# EAGLE design android (EAGLE 5.12)
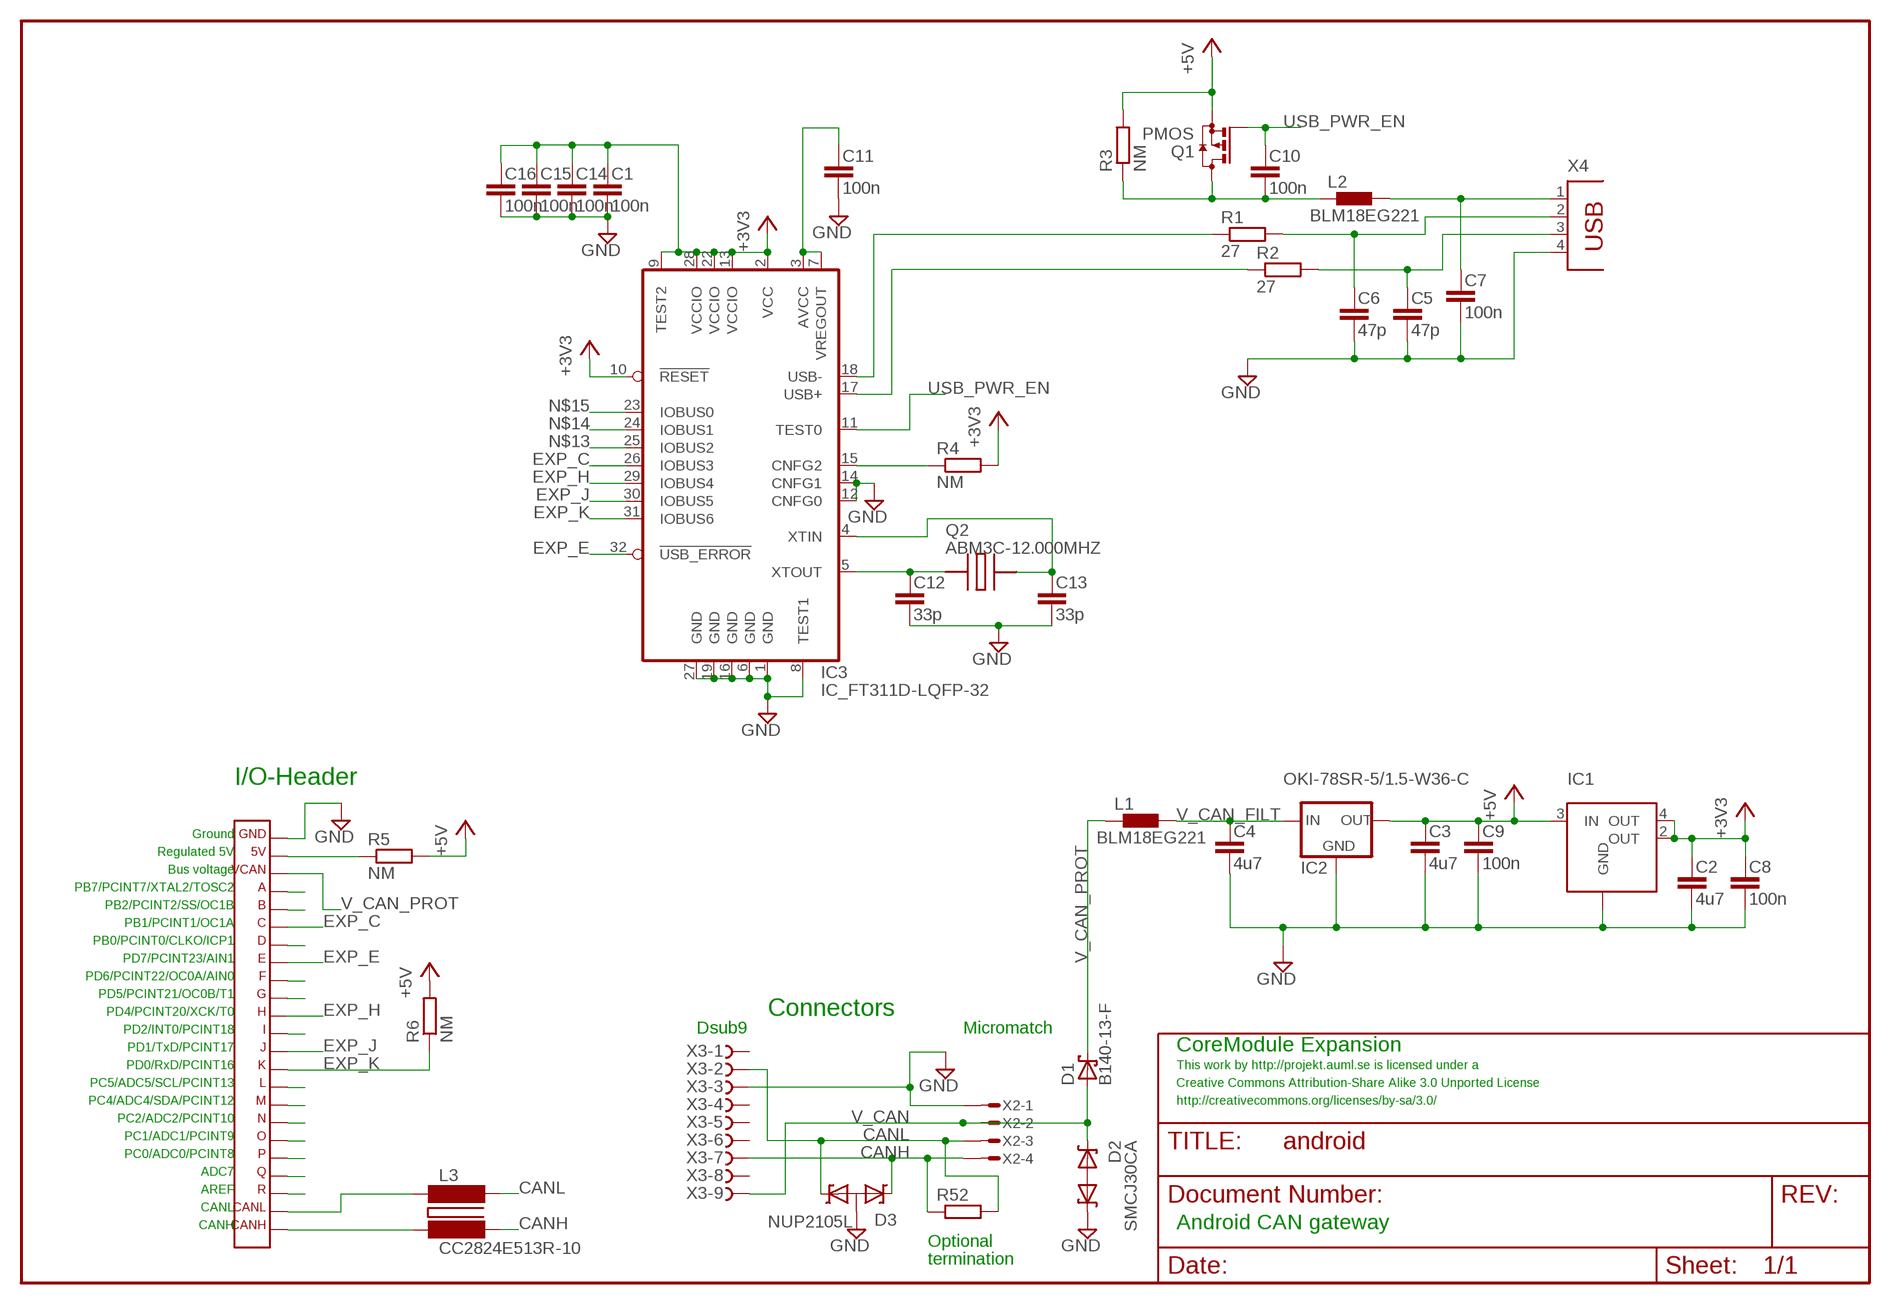
[diagram p0: schematic, sheet 1]

## Parts
C1  100n  C-EUC0603  [C0603]
C2  4u7  C-EUC0805  [C0805]
C3  4u7  C-EUC0805  [C0805]
C4  4u7  C-EUC0805  [C0805]
C5  47p  C-EUC0603  [C0603]
C6  47p  C-EUC0603  [C0603]
C7  100n  C-EUC0603  [C0603]
C8  100n  C-EUC0603  [C0603]
C9  100n  C-EUC0603  [C0603]
C10  100n  C-EUC0603  [C0603]
C11  100n  C-EUC0603  [C0603]
C12  33p  C-EUC0603  [C0603]
C13  33p  C-EUC0603  [C0603]
C14  100n  C-EUC0603  [C0603]
C15  100n  C-EUC0603  [C0603]
C16  100n  C-EUC0603  [C0603]
D1  B140-13-F  SCHOTTKY-DIODESMA  [SMA]
D2  SMCJ30CA  TVS2SMC  [SMC]
D3  NUP2105L  TVSSOT23  [SOT23]
IC1  LM1117IMPX-3.3  LM1117MP-3.3  [SOT223]
IC2  OKI-78SR-5/1.5-W36-C  78XXS"  [78XXS]
IC3  IC_FT311D-LQFP-32  [LQFP-32]
L1  BLM18EG221  L-EUL0603  [L0603]
L2  BLM18EG221  L-EUL0603  [L0603]
L3  CC2824E513R-10  CC2824E513R-10CC2824E513R-10  [CC2824E513R-10]
Q1  PMOS  [SOT23]
Q2  ABM3C-12.000MHZ  ABMMABM3C  [SMD2]
R1  27  R-EUR0603  [R0603]
R2  27  R-EUR0603  [R0603]
R3  NM  R-EUR0603  [R0603]
R4  NM  R-EUR0603  [R0603]
R5  NM  R-EUR0603  [R0603]
R6  NM  R-EUR0603  [R0603]
R52  R-EUR2010  [R2010]
X1  CORETWO_LAYOUTISPHOLES_CU  [CORETWO_LAYOUT_ISPHOLES_CU]
X2  MICROMATCH-4  [MICROMATCH-4]
X3  F09S  F09HS  [F09H]
X4  USB_TYPARECEPTACLE  [FCI_RECEPTACLE]

## Nets
+3V3: C1.1 C2.1 C8.1 C14.1 C15.1 C16.1 IC1.2(OUT) IC1.4(OUT) IC3.2(VCC) IC3.9(TEST2) IC3.10(!RESET) IC3.13(VCCIO) IC3.22(VCCIO) IC3.28(VCCIO) R4.2
+5V: C3.1 C9.1 IC1.3(IN) IC2.OUT Q1.2(S) R3.2 R5.2 R6.2
CANH: D3.1(C1) L3.3 R52.1 X2.4 X3.7
CANH_FILT: L3.2 X1.CANH
CANL: D3.2(C2) L3.4 R52.2 X2.3 X3.2
CANL_FILT: L3.1 X1.CANL
EXP_A: X1.A
EXP_B: X1.B
EXP_C: IC3.26(IOBUS3) X1.C
EXP_D: X1.D
EXP_E: IC3.32(!USB_ERROR) X1.E
EXP_F: X1.F
EXP_G: X1.G
EXP_H: IC3.29(IOBUS4) X1.H
EXP_I: X1.I
EXP_J: IC3.30(IOBUS5) X1.J
EXP_K: IC3.31(IOBUS6) R6.1 X1.K
EXP_L: X1.L
EXP_M: X1.M
EXP_N: X1.N
EXP_O: X1.O
EXP_P: X1.P
EXP_Q: X1.Q
EXP_R: X1.R
GND: C1.2 C2.2 C3.2 C4.2 C5.2 C6.2 C7.2 C8.2 C9.2 C11.2 C12.2 C13.2 C14.2 C15.2 C16.2 D2.A(C1) D3.3(A) IC1.1(GND) IC2.GND IC3.1(GND) IC3.6(GND) IC3.8(TEST1) IC3.12(CNFG0) IC3.14(CNFG1) IC3.16(GND) IC3.19(GND) IC3.27(GND) X1.GND X2.1 X3.3 X4.4
N$1: C7.1 L2.2 X4.1
N$2: C10.2 L2.1 Q1.3(D) R3.1
N$5: IC3.17(USB+) R2.1
N$6: IC3.18(USB-) R1.1
N$7: C6.1 R1.2 X4.2
N$8: C5.1 R2.2 X4.3
N$10: IC3.15(CNFG2) R4.1
N$12: C11.1 IC3.3(AVCC) IC3.7(VREGOUT)
N$13: IC3.25(IOBUS2)
N$14: IC3.24(IOBUS1)
N$15: IC3.23(IOBUS0)
N$16: C13.1 IC3.4(XTIN) Q2.2
N$17: C12.1 IC3.5(XTOUT) Q2.1
USB_PWR_EN: C10.1 IC3.11(TEST0) Q1.1(G)
V_CAN: D1.A D2.C(C2) X2.2 X3.9
V_CAN_FILT: C4.1 IC2.IN L1.2
V_CAN_PROT: D1.C L1.1 X1.VCAN
VCC: R5.1 X1.5V
Unconnected: X3.1 X3.4 X3.5 X3.6 X3.8

## Notes on the sheet
- I/O-Header
- Ground
- Regulated 5V
- Bus voltage
- PB7/PCINT7/XTAL2/TOSC2
- PB2/PCINT2/SS/OC1B
- PB1/PCINT1/OC1A
- PB0/PCINT0/CLKO/ICP1
- PD7/PCINT23/AIN1
- PD6/PCINT22/OC0A/AIN0
- PD5/PCINT21/OC0B/T1
- PD4/PCINT20/XCK/T0 | Connectors
- PD2/INT0/PCINT18 | Dsub9 | Micromatch
- PD1/TxD/PCINT17 | CoreModule Expansion
- PD0/RxD/PCINT16 | This work by http://projekt.auml.se is licensed under a
- PC5/ADC5/SCL/PCINT13 | Creative Commons Attribution-Share Alike 3.0 Unported License
- PC4/ADC4/SDA/PCINT12 | http://creativecommons.org/licenses/by-sa/3.0/
- PC2/ADC2/PCINT10
- PC1/ADC1/PCINT9
- PC0/ADC0/PCINT8
- ADC7
- AREF
- CANL
- CANH | Android CAN gateway
- Optional
- termination

## Power pins joined to a net without a drawn wire
GND: Q2.GND@0(GND) Q2.GND@1(GND)

## Library data of the parts
C1-C16 = rcl:C-EU
D1 = diode:SCHOTTKY-DIODE
D2 = diode:TVS2
D3 = diode:TVS
IC1 = lm1117mp:LM1117MP-3.3
IC2 = 78xx:78XXS: VOLTAGE REGULATOR
IC3 = dp_devices:IC_FT311D: USB Android Host Mfr no: FT311D-32L1C FT311D <http://www.ftdichip.com/Support/Documents/DataSheets/ICs/DS_FT311D.pdf>
L1 L2 = rcl:L-EU
L3 = choke:CC2824E513R-10
Q1 = transistor:PMOS
Q2 = abmm:ABMM
R1-R6 R52 = rcl:R-EU
X1 = expboard:CORETWO_LAYOUT
X2 = con-amp-micromatch:MICROMATCH-4: MicroMaTch 4 7-215464-4 / 0-215464-4 Drawing Number C-215464 DDEController.pdf
X3 = dsub:F09?S
X4 = usba:USB_TYPA

## Board
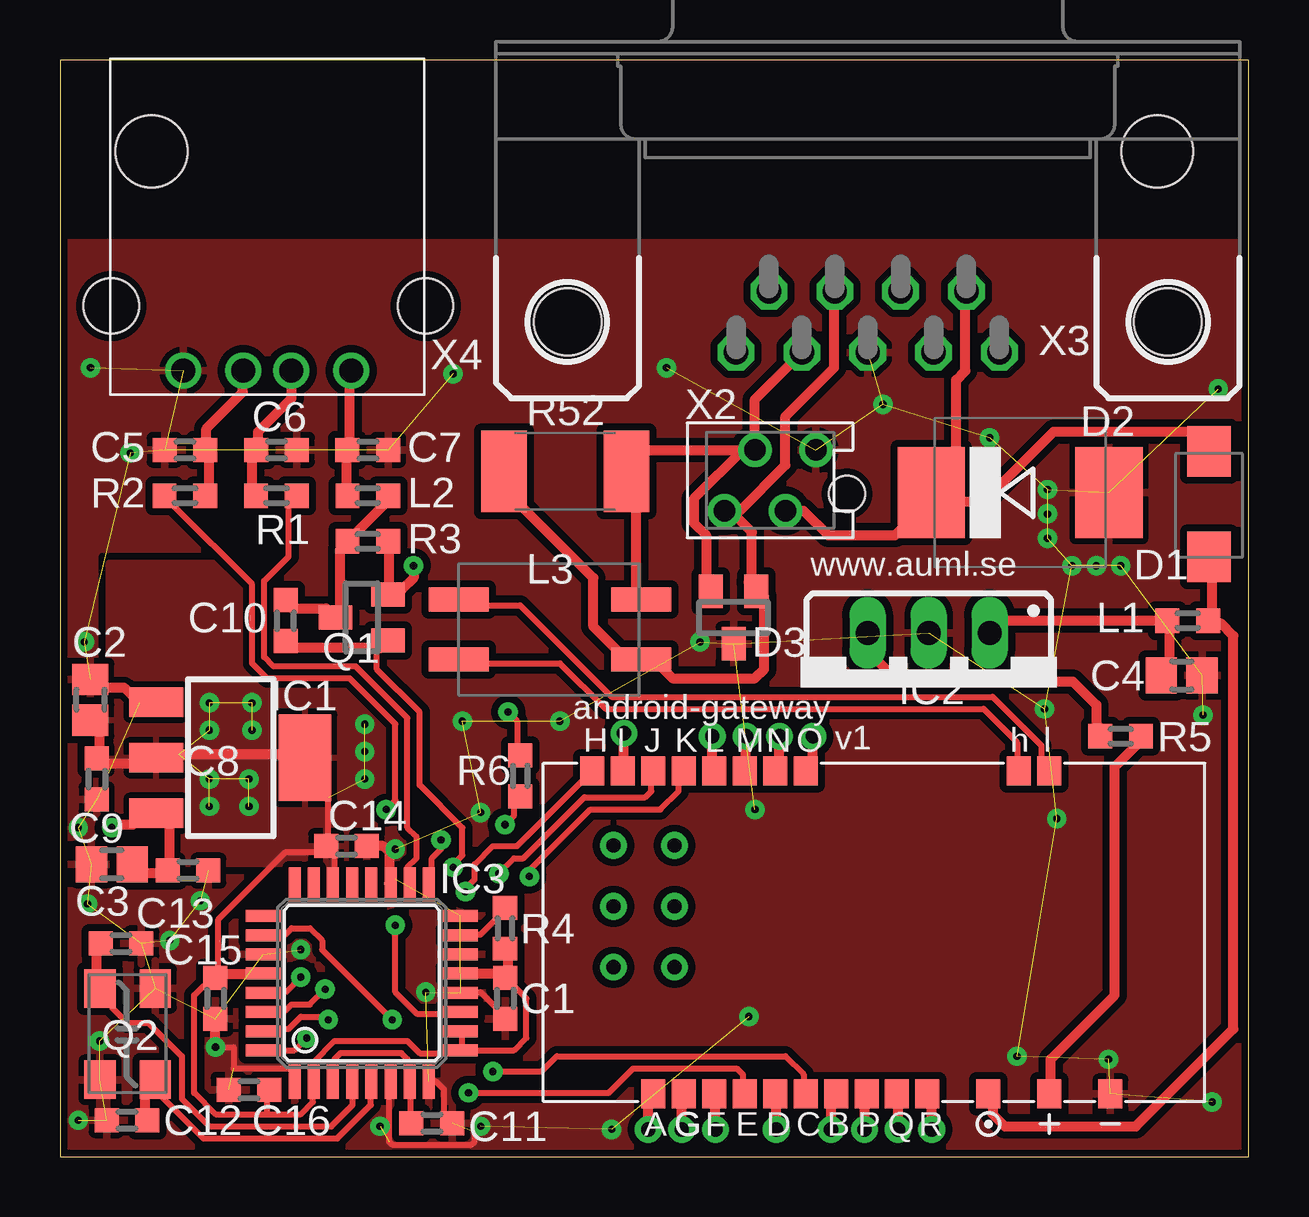
[diagram p1: board, top side]
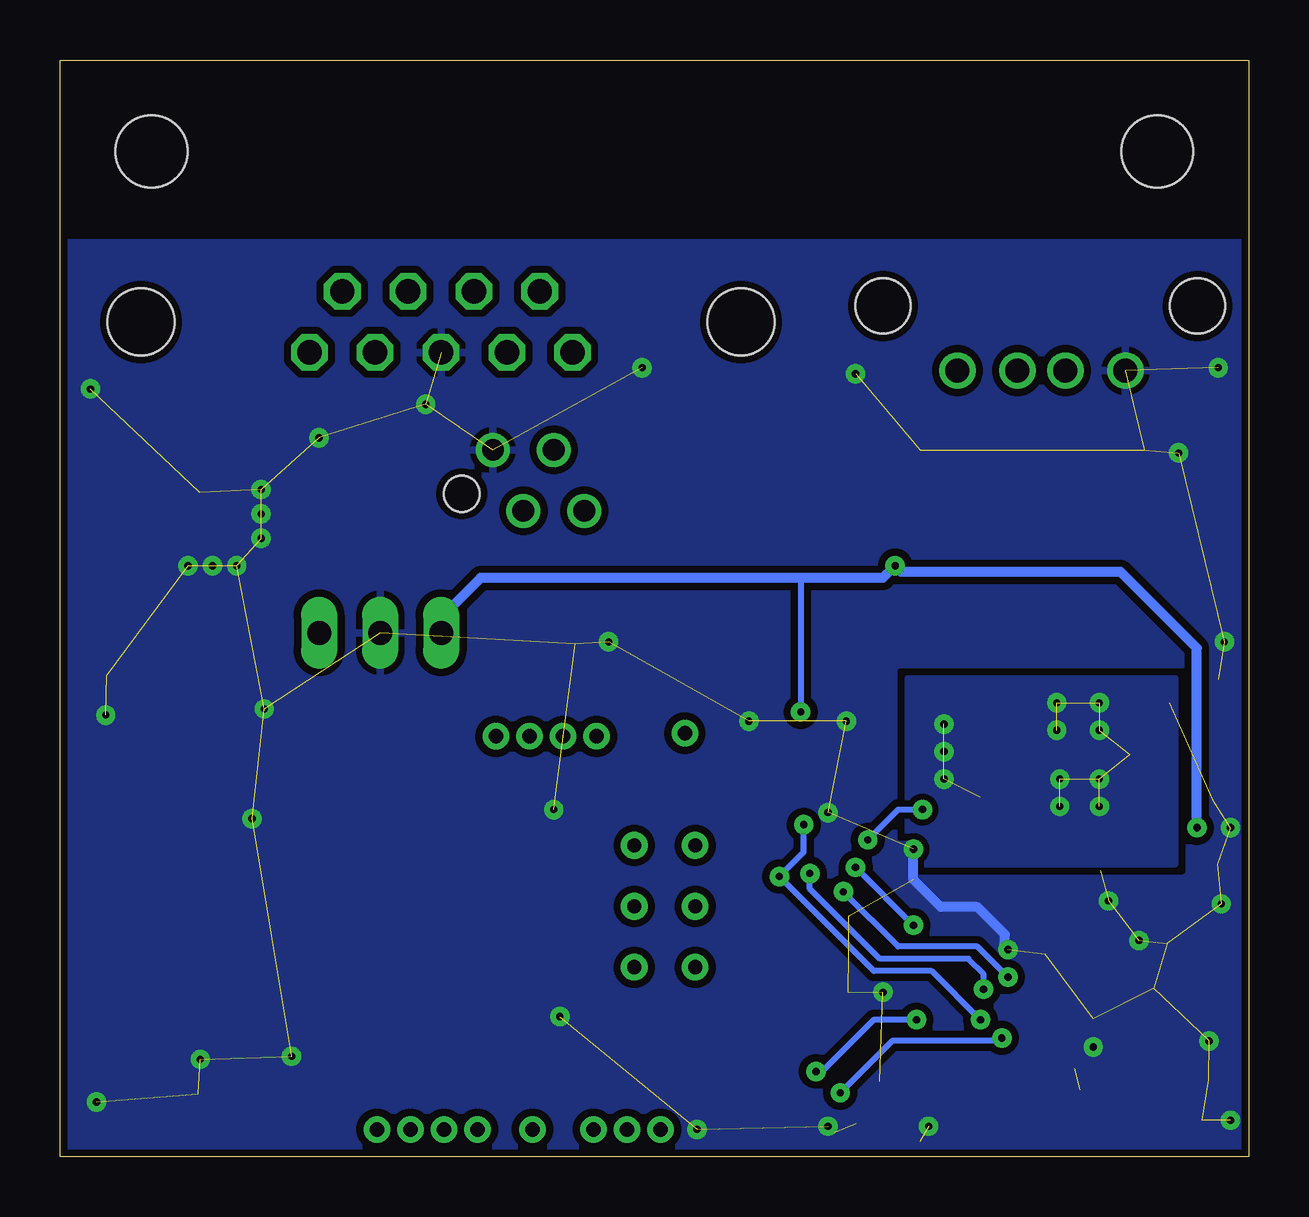
[diagram p2: board, bottom side, seen from below]

Size 49.53 x 45.72 mm. Coordinates in mm from the lower left corner, seen from the top.
Outline: 0,0 49.53,0 49.53,45.72 0,45.72 0,0
Copper layers (1*16): Top 0.035mm / dielectric 1.5mm / Bottom 0.035mm
Design rules "default *": minimum track width 10mil, minimum drill 0.3mm, track to track 10mil, track to pad 10mil, pad to pad 10mil, via to via 10mil, smd to smd 8mil, copper to edge 10mil, drill to drill 8mil, minimum pad ring 10mil, minimum via ring 10mil, stop-mask expansion 4mil, vias tented up to drill 18mil, thermal gap 10mil
Holes 3 mm at 3.81,41.91 45.72,41.91

### Footprints (pad centres in the part's own frame; a part is rotated, then mirrored left to right if it is on the bottom)
C0603 = smd 1 x 1: 1 -0.85,0; 2 0.85,0
C0805 = smd 1.3 x 1.5: 1 -0.85,0; 2 0.85,0
SMA = smd 2.1 x 1.8: A 2.1,0; C -2.3,0
SMC = smd 2.8 x 3.8: A 3.7,0; C -3.7,0
SOT23 = smd 1 x 1.4: 1 -0.95,-1.1; 2 0.95,-1.1; 3 0,1.1
SOT223 = smd 1.219 x 2.235: 1 -2.311,-3.099; 2 0,-3.099; 3 2.311,-3.099 | smd 3.6 x 2.2: 4 0,3.099
78XXS = drill 1 long: GND 0,-2.54; IN -2.54,-2.54; OUT 2.54,-2.54
LQFP-32 = smd 0.5 x 1.45: 1 -2.8,-4.1; 2 -2,-4.1; 3 -1.2,-4.1; 4 -0.4,-4.1; 5 0.4,-4.1; 6 1.2,-4.1; 7 2,-4.1; 8 2.8,-4.1; 17 2.8,4.1; 18 2,4.1; 19 1.2,4.1; 20 0.4,4.1; 21 -0.4,4.1; 22 -1.2,4.1; 23 -2,4.1; 24 -2.8,4.1 | smd 1.45 x 0.5: 9 4.1,-2.8; 10 4.1,-2; 11 4.1,-1.2; 12 4.1,-0.4; 13 4.1,0.4; 14 4.1,1.2; 15 4.1,2; 16 4.1,2.8; 25 -4.1,2.8; 26 -4.1,2; 27 -4.1,1.2; 28 -4.1,0.4; 29 -4.1,-0.4; 30 -4.1,-1.2; 31 -4.1,-2; 32 -4.1,-2.8
L0603 = smd 0.991 x 1.016: 1 -0.85,0; 2 0.85,0
CC2824E513R-10 = smd 2.5 x 1: 1 1,-0.4; 2 1,-2.9; 3 8.6,-2.9; 4 8.6,-0.4
SMD2 = smd 1.6 x 1.3: 1 0.8,-2.95; 2 4.6,-0.65; GND@0 0.8,-0.65; GND@1 4.6,-2.95
R0603 = smd 0.991 x 1.016: 1 -0.85,0; 2 0.85,0
R2010 = smd 1.9 x 3.4: 1 -1.95,0; 2 3.15,0
CORETWO_LAYOUT_ISPHOLES_CU = smd 1 x 1.2: 5V 7.315,-6.648; A -9.195,-6.648; B -1.575,-6.648; C -2.845,-6.648; CANH 6.045,6.814; CANL 7.315,6.814; D -4.115,-6.648; E -5.385,-6.648; F -6.655,-6.648; G -7.925,-6.648; GND 9.855,-6.648; H -11.735,6.814; I -10.465,6.814; J -9.195,6.814; K -7.925,6.814; L -6.655,6.814; M -5.385,6.814; N -4.115,6.814; O -2.845,6.814; P -0.305,-6.648; Q 0.965,-6.648; R 2.235,-6.648; VCAN 4.775,-6.648 | drill 0.6 round: P$1 -10.846,3.708; P$2 -8.306,3.708; P$3 -10.846,1.168; P$4 -8.306,1.168; P$5 -8.306,-1.372; P$6 -10.846,-1.372
MICROMATCH-4 = drill 0.9 round: 1 1.905,1.27; 2 0.635,-1.27; 3 -0.635,1.27; 4 -1.905,-1.27 | hole 1.5: 3.199,-0.562
F09H = drill 1.016 octagon: 1 -5.486,-1.27; 2 -2.743,-1.27; 3 0,-1.27; 4 2.743,-1.27; 5 5.486,-1.27; 6 -4.115,1.27; 7 -1.372,1.27; 8 1.372,1.27; 9 4.115,1.27 | hole 2.8: -12.5,0; 12.5,0
FCI_RECEPTACLE = drill 1 round: 1 -3.5,0; 2 -1,0; 3 1,0; 4 3.5,0 | hole 2.3: 6.5,-2.7; -6.6,-2.7

### Placement (x,y rotation side)
C1  18.54,6.6 270 top
C2  1.27,19.05 90 top
C3  2.16,12.19 180 top
C4  46.74,20.07 0 top
C5  5.21,29.46 180 top
C6  9.02,29.46 0 top
C7  12.83,29.46 0 top
C8  1.52,15.75 270 top
C9  5.33,11.94 0 top
C10  9.4,22.35 90 top
C11  15.49,1.4 0 top
C12  2.79,1.52 180 top
C13  2.54,8.89 0 top
C14  11.94,12.95 0 top
C15  6.48,6.6 270 top
C16  7.87,2.79 180 top
D1  47.88,27.3 90 top
D2  40.01,27.69 0 top
D3  28.07,22.48 180 top
IC1  7.11,16.64 270 top
IC2  36.2,19.3 180 top
IC3  12.57,7.24 0 top
L1  46.99,22.35 180 top
L2  12.83,27.56 180 top
L3  15.62,23.62 0 top
Q1  12.57,22.48 90 top
Q2  1.02,2.41 90 top
R1  9.02,27.56 180 top
R2  5.21,27.56 0 top
R3  12.83,25.65 0 top
R4  18.54,9.53 270 top
R5  44.2,17.53 180 top
R6  19.18,15.88 90 top
R52  20.45,28.57 0 top
X1  33.91,9.27 0 top
X2  29.59,28.19 0 top
X3  33.66,34.8 0 top
X4  8.64,32.77 180 top

### Tracks (layer width: path | path; a pad name or v marks a point on that pad's centre or on a via)
+3V3  (via drill 0.3)  (11 unrouted)
  Top 0.254: C16.1 8.6,2.71 | C16.1 8.51,2.92 | IC3.9 16.13,4.45 16,4.32 14.99,4.32 14.48,4.83 11.43,4.83 10.57,3.97 IC3.2 10.54,3.11 10.54,2.29 10.03,1.78 8.64,1.78 | IC3.9 16.89,4.44 16.89,4.45 18.92,4.45 19.43,4.95 19.43,6.6 18.92,7.11 18.88,7.11 C1.1 | IC3.10 16.73,5.24 16.76,5.21 16.76,4.53 IC3.9 | 11.05,12.7 11.3,12.95 C14.1 11.18,13.12 11.18,14.99 10.21,15.95 IC1.4 | 11.05,12.7 9.4,12.7 6.6,9.91 6.6,7.58 C15.1 6.13,7.11 5.97,7.11 5.59,6.73 5.59,2.67 6.48,1.78 8.64,1.78 | 11.05,12.7 11.43,12.7 11.43,11.4 IC3.22 | 8.64,1.78 8.64,2.88 C16.1
  Top 0.406: C15.1 6.57,7.45 6.73,7.62 8.45,7.62 IC3.28 | IC3.13 16.69,7.62 18.16,7.62 18.33,7.45 C1.1 18.67,7.58 18.67,8.64 18.54,8.76 R4.2 | C2.1 1.27,18.16 1.65,17.78 1.65,16.34 C8.1 1.61,16.47 1.78,16.38 3.76,16.38 IC1.2 4.83,16.64 4.95,16.76 10.08,16.76 IC1.4
  other vias: 6.22,18.92 6.22,17.78 6.22,15.75 6.22,14.61 8,18.92 8,17.78 7.87,15.75 7.87,14.61 12.7,18.03 12.7,16.89 12.7,15.75
  pour Top: 14.22,19.94 14.22,12.19 2.03,12.19 2.03,24.77 8,24.77 8,19.94
  pour Bottom: 14.22,19.94 14.22,12.19 3.05,12.19 3.05,19.94
+5V  (via drill 0.3)
  Top 0.254: 19.05,16.6 19.05,18.16 v18.67,18.54
  Top 0.406: IC2.OUT 33.66,21.08 34.92,19.81 42.2,19.81 43.18,18.84 43.18,18.03 43.35,17.87 R5.2 | R3.2 13.72,25.61 13.72,23.75 13.67,23.71 Q1.2 13.87,23.62 14.22,23.62 14.73,24.13 v14.73,24.64 | C3.1 3.01,12.1 3.3,11.81 4.74,11.81 C9.1 4.45,11.94 4.57,12.19 4.57,14.1 4.24,14.1 | 4.24,14.1 IC1.3 | 4.24,14.1 3.3,14.1 3.05,13.84 2.29,13.84 v2.16,13.72 | 19.05,16.6 R6.2
  Bottom 0.254: v18.67,18.54 18.67,24 18.54,24.13
  Bottom 0.406: IC2.OUT 33.66,22.48 32,24.13 18.54,24.13 15.24,24.13 v14.73,24.64 14.48,24.38 5.33,24.38 2.16,21.21 v2.16,13.72
CANH
  Top 0.406: R52.1 19.18,27.89 19.18,27.18 22.23,24.13 22.23,22.1 23.37,20.95 23.37,20.83 23.47,20.72 L3.3 24.74,20.72 25.53,19.94 28.96,19.94 29.34,20.32 29.34,23.37 29.21,23.5 29.21,23.58 D3.1 28.7,23.89 28.7,24 28.83,24.13 28.83,26.04 27.94,26.92 X2.4 28.32,26.92 30.23,28.83 30.23,30.86 32.26,32.89 32.26,36.04 X3.7
CANH_FILT
  Top 0.254: L3.2 17.5,20.72 17.65,20.57 20.83,20.57 22.73,18.67 38.48,18.67 39.88,17.27 39.88,16.16 X1.CANH
CANL
  Top 0.406: 28.45,29.46 24.38,29.46 23.6,28.68 R52.2 24.13,28.04 24.13,27.05 24,26.92 24,23.44 L3.4 | 28.45,29.46 X2.3 28.96,31.57 X3.2 | D3.2 27.12,23.81 26.92,24 26.92,25.91 26.42,26.42 26.42,27.43 28.45,29.46
CANL_FILT
  Top 0.254: 17.42,23.22 17.65,22.99 19.18,22.99 22.99,19.18 38.86,19.18 40.89,17.14 40.89,16.41 X1.CANL
  Top 0.406: L3.1 17.42,23.22
EXP_A  (via drill 0.6)
  Top 0.406: v24.51,1.14 24.51,2.42 X1.A
EXP_B  (via drill 0.6)
  Top 0.406: v32.13,1.14 32.13,2.42 X1.B
EXP_C  (via drill 0.3)
  Top 0.254: IC3.26 8.98,9.24 9.02,9.27 9.4,9.27 9.65,9.53 10.41,9.53 10.92,9.02 10.92,8.64 v13.84,5.71 | v18.03,3.56 20.07,3.56 20.7,4.19 30.23,4.19 30.99,3.43 30.99,2.7 X1.C
  Bottom 0.254: v13.84,5.71 15.62,5.71 17.78,3.56 v18.03,3.56
EXP_D  (via drill 0.6)
  Top 0.406: v29.84,1.14 29.84,2.57 X1.D
EXP_E  (via drill 0.3)
  Top 0.254: IC3.32 9.01,4.44 9.02,4.45 9.78,4.45 v10.29,4.95 | v17.02,2.67 22.86,2.67 23.88,3.68 28.19,3.68 28.45,3.43 28.45,2.7 X1.E
  Bottom 0.254: v10.29,4.95 10.41,4.95 10.54,4.83 14.86,4.83 v17.02,2.67
EXP_F  (via drill 0.6)
  Top 0.406: v27.3,1.14 27.3,2.57 X1.F
EXP_G  (via drill 0.6)
  Top 0.406: v25.91,1.14 25.91,2.55 X1.G
EXP_H  (via drill 0.3)
  Top 0.254: IC3.29 9,6.84 9.02,6.86 9.4,6.86 v10.03,7.49 | v16.89,11.05 17.02,11.18 17.02,11.3 17.27,11.56 17.27,12.19 18.03,12.95 19.05,12.95 21.84,15.75 X1.H
  Bottom 0.254: v10.03,7.49 11.3,8.76 14.61,8.76 v16.89,11.05
EXP_I  (via drill 0.6)
  Top 0.406: v23.5,17.65 23.5,16.14 X1.I
EXP_J  (via drill 0.3)
  Top 0.254: IC3.30 8.96,6.04 9.02,6.1 9.4,6.1 9.65,6.35 10.41,6.35 v11.05,6.99 | v18.29,11.81 18.92,12.45 19.3,12.45 21.84,14.99 24.38,14.99 24.64,15.24 24.64,16.01 X1.J
  Bottom 0.254: v11.05,6.99 11.05,7.62 11.68,8.26 15.37,8.26 18.29,11.18 v18.29,11.81
EXP_K  (via drill 0.3)
  Top 0.254: IC3.31 8.92,5.24 9.02,5.33 9.53,5.33 10.03,5.84 11.05,5.84 v11.18,5.71 | v19.56,11.68 19.56,11.94 22.1,14.48 25.02,14.48 25.78,15.24 25.78,15.88 X1.K | 18.92,14.73 18.92,14.22 v18.54,13.84
  Top 0.406: R6.1 19.18,14.86 18.92,14.73
  Bottom 0.254: v11.18,5.71 13.21,7.75 15.62,7.75 v19.56,11.68 18.54,12.7 v18.54,13.84
EXP_L  (via drill 0.6)
  Top 0.406: v27.18,17.53 27.18,16.16 X1.L
EXP_M  (via drill 0.6)
  Top 0.406: v28.57,17.53 28.57,16.14 X1.M
EXP_N  (via drill 0.6)
  Top 0.406: v29.97,17.53 29.97,16.26 X1.N
EXP_O  (via drill 0.6)
  Top 0.406: v31.37,17.53 31.37,16.39 X1.O
EXP_P  (via drill 0.6)
  Top 0.406: v33.53,1.14 33.53,2.55 X1.P
EXP_Q  (via drill 0.6)
  Top 0.406: v34.92,1.14 34.92,2.57 X1.Q
EXP_R  (via drill 0.6)
  Top 0.406: v36.32,1.14 36.32,2.44 X1.R
GND  (via drill 0.3)  (62 unrouted)
  Top 0.254: C1.2 18.38,5.75 18.16,5.97 18.16,6.22 17.53,6.86 16.69,6.86 IC3.12 | IC3.1 9.77,3.56 9.65,3.68 7.24,3.68 7.24,4.57 v6.48,4.57 | IC3.6 13.77,2.6 13.72,2.54 13.72,0.64 13.84,0.51 17.14,0.51 17.27,0.64 17.27,1.02 v17.53,1.27 | IC3.8 15.66,3.14 16,2.79 16,1.74 C11.2
  Top 0.406: C2.2 1.44,19.9 1.78,19.56 2.67,19.56 3.3,18.92 3.99,18.92 IC1.1 | v6.48,4.57 C15.2 | C14.2 13.46,12.95 13.72,12.7 | 13.72,12.7 13.72,11.4 IC3.19 | IC3.12 17.13,6.84 17.14,6.86 | 13.72,12.7 13.97,12.7 v13.97,12.83
  Bottom 0.406: v13.97,12.83 13.97,11.56 12.83,10.41 11.3,10.41 10.16,9.27 10.16,8.76 v10.03,8.64
  other vias: 41.15,27.81 41.15,26.8 41.15,25.78 42.16,24.64 43.18,24.64 44.2,24.64 47.62,18.41 26.67,21.46 2.92,29.34 1.02,21.46 0.76,13.72 1.14,10.54 5.84,10.67 4.57,9.02 1.65,4.83 0.76,1.52 15.24,6.86 13.34,1.27 43.69,4.06 39.88,4.19 41.53,14.1 28.96,14.48 28.7,5.84 16.76,18.16 20.83,18.16 17.53,14.35 41.02,18.67 1.27,32.89 48.26,32 48.01,2.29 22.99,1.14 16.38,32.64 25.27,32.89 34.29,31.37 38.73,29.97
  pour Bottom (isolate 0.305, rank 3): 0,38.1 49.53,38.1 49.53,0 0,0
  pour Top (isolate 0.305, rank 3): 0,38.1 49.53,38.1 49.53,0 0,0
N$1
  Top 0.406: X4.1 12.14,32.71 12.06,32.64 12.06,29.55 C7.1 11.98,29.25 11.94,29.21 11.94,27.6 L2.2
N$2
  Top 0.406: L2.1 13.68,27.39 13.59,27.3 13.59,27.27 R3.1 11.68,25.36 11.68,22.73 11.47,22.52 Q1.3 11.09,22.86 9.65,22.86 9.4,23.11 C10.2
N$5  (via drill 0.3)
  Top 0.254: R2.1 4.45,27.56 4.7,27.3 4.7,27.18 8,23.88 8,20.57 8.64,19.94 12.06,19.94 13.97,18.03 13.97,14.86 v13.59,14.48 | v15.88,13.21 15.88,12.83 15.49,12.45 15.49,11.46 IC3.17
  Bottom 0.254: v13.59,14.48 14.61,14.48 v15.88,13.21
N$6
  Top 0.254: R1.1 9.87,27.52 9.53,27.18 9.53,25.02 8.51,24 8.51,20.83 8.89,20.45 12.32,20.45 14.48,18.29 14.48,13.72 14.86,13.34 14.86,12.45 14.48,12.06 14.48,11.43 IC3.18
N$7
  Top 0.406: X4.2 9.64,32.53 9.65,32.51 9.65,31.62 8.26,30.23 8.26,29.55 C6.1 8.17,29.38 8,29.21 8,27.73 R1.2
N$8
  Top 0.406: X4.3 7.64,32.66 7.62,32.64 7.62,31.88 6.1,30.35 6.1,29.5 C5.1 6.1,29.46 6.22,29.34 6.22,27.73 R2.2
N$10
  Top 0.254: IC3.15 17.24,9.24 17.27,9.27 17.53,9.27 18.16,9.91 18.16,10.12 R4.1
N$12
  Top 0.254: C11.1 14.64,1.61 14.61,1.65 14.61,3.11 IC3.7 14.48,3.23 14.48,4.06 14.22,4.32 11.68,4.32 11.43,4.06 11.43,3.68 11.37,3.63 IC3.3
N$16
  Top 0.254: Q2.2 1.67,6.97 2.16,6.48 2.16,6.22 2.79,5.59 3.68,5.59 5.08,4.19 5.08,2.41 6.22,1.27 11.3,1.27 12.19,2.16 12.19,3.12 IC3.4
  Top 0.406: C13.1 1.65,8.89 1.52,8.76 1.52,7.16 Q2.2
N$17
  Top 0.254: Q2.1 4.03,3.21 4.45,2.79 4.19,2.54 5.97,0.76 11.56,0.76 12.95,2.16 12.95,3.12 IC3.5
  Top 0.406: C12.1 3.43,1.52 3.56,1.65 3.56,2.8 Q2.1
USB_PWR_EN  (via drill 0.3)
  Top 0.254: 13.21,21.21 13.21,20.32 14.99,18.54 14.99,15.49 16.76,13.72 16.76,12.57 16.38,12.19 v16.38,12.06 | v13.97,9.65 13.97,6.86 14.86,5.97 16.6,5.97 IC3.11
  Top 0.406: C10.1 9.4,21.46 9.65,21.21 13.21,21.21 13.35,21.21 Q1.1
  Bottom 0.254: v13.97,9.65 v16.38,12.06
V_CAN
  Top 0.406: X2.2 30.99,26.92 32,25.91 34.8,25.91 35.31,26.42 35.31,26.69 D2.C | D2.C 36.3,28.18 37.34,29.21 37.34,32.38 37.72,32.77 37.72,36.02 X3.9 | D1.A 47.88,29.72 47.37,30.23 41.4,30.23 38.48,27.3 36.96,27.3 36.83,27.43 36.56,27.43 D2.C
V_CAN_FILT
  Top 0.406: C4.1 46.23,20.23 46.23,22.1 46.14,22.19 L1.2 39.24,22.35 IC2.IN
V_CAN_PROT
  Top 0.406: D1.C 47.88,24.26 48.01,24.13 48.01,22.52 L1.1 48.01,22.35 48.13,22.23 48.39,22.23 48.9,21.72 48.9,5.33 44.83,1.27 39.37,1.27 38.86,1.78 38.86,2.44 X1.VCAN
VCC
  Top 0.406: X1.5V 41.27,2.67 41.27,4.06 43.94,6.73 43.94,16.26 45.05,17.36 R5.1

### Text on the board
tPlace: www.auml.se | android-gateway | v1
Document: Creative Commons Attribution-Share Alike 3.0 Unported License | This work by http://projekt.auml.se is licensed under a | http://creativecommons.org/licenses/by-sa/3.0/